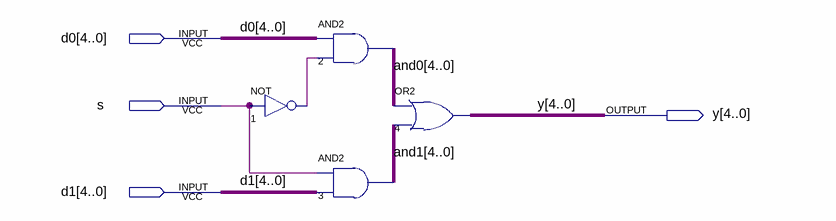
[diagram p0: schematic sheet]
// Quartus schematic 2x5mux.bdf as structural Verilog: 4 symbols, 4 pins
module \2x5mux  (
  input  [4:0] d0,
  input  s,
  input  [4:0] d1,
  output [4:0] y
);

  wire n1_out;
  wire [4:0] and0, and1;

  not u_1 (n1_out, s);
  assign and0 = d0 & {5{n1_out}};  // AND2 2, 5 bits wide
  assign and1 = {5{s}} & d1;  // AND2 3, 5 bits wide
  assign y = and0 | and1;  // OR2 4, 5 bits wide
endmodule
